# EAGLE design TCRT1010_VIS_onechannel (EAGLE 9.6.2)

## Sheet 1 of 2
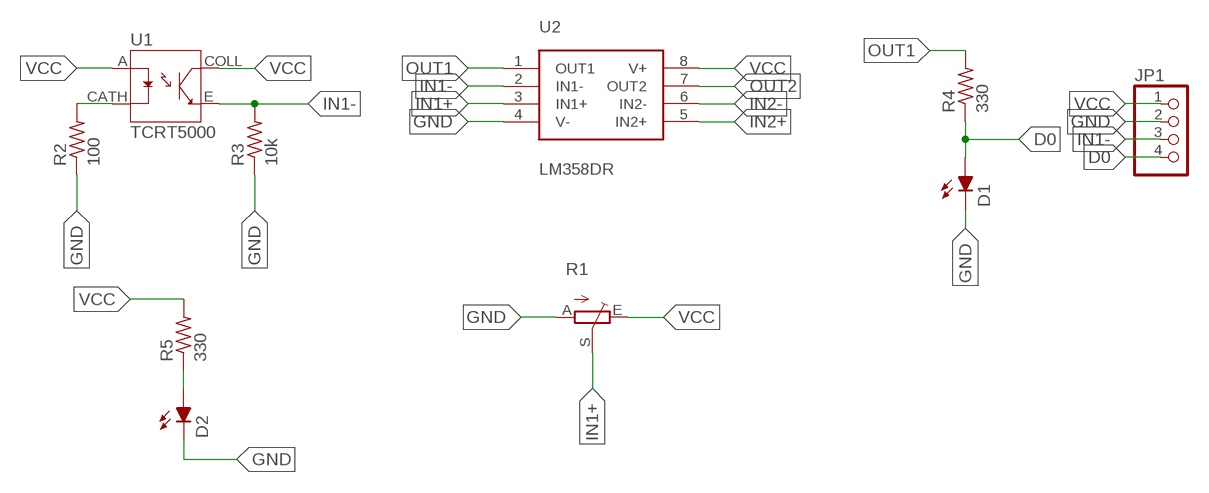
[diagram p0: schematic, sheet 1]

### Parts
D1  LED_LEDCHIP-LED0603MP  [LED_CHIP-LED0603MP]
D2  LED_LEDCHIP-LED0603MP  [LED_CHIP-LED0603MP]
JP1  PINHD-1X4  [1X04]
R1  TRIM_EU-CA6V  [CA6V]
R2  100  R-US_R0805  [R0805]
R3  10k  R-US_R0603  [R0603]
R4  330  R-US_R0603  [R0603]
R5  330  R-US_R0603  [R0603]
U1  TCRT5000  [OPTO_TCRT5000]
U2  LM358DR  [LM358DR]

### Nets
D0: D1.A JP1.4 R4.1
GND: D1.C D2.C JP1.2 R1.A R2.1 R3.1 U2.4(V-)
IN1+: R1.S U2.3(IN1+)
IN1-: JP1.3 R3.2 U1.E U2.2(IN1-)
IN2+: U2.5(IN2+)
IN2-: U2.6(IN2-)
N$1: R2.2 U1.CATH
N$2: D2.A R5.1
OUT1: R4.2 U2.1(OUT1)
OUT2: U2.7(OUT2)
VCC: JP1.1 R1.E R5.2 U1.A U1.COLL U2.8(V+)

## Sheet 2 of 2

## Library data of the parts
D1 D2 = 52101-101-REV-A_v16:LED_LED: LED Various Types
JP1 = MIA_LIBRARY-2-2-2:PINHD-1X4: PIN HEADER
R1 = MIA_LIBRARY-2-2-2:TRIM_EU-: POTENTIOMETER
R2-R5 = rcl:R-US_: RESISTOR, American symbol; SPICEPREFIX: R
U1 = TCRT5000:TCRT5000: 950 nm 60 mA Through Hole Reflective Optical Sensor with Transistor Output Check availability <https://pricing.snapeda.com/parts/TCRT5000/Vishay/view-part?ref=eda>; AVAILABILITY: In Stock; DESCRIPTION: Reflective Optical Sensor 0.591 (15mm) PCB Mount; MF: Vishay; MP: TCRT5000; PACKAGE: TCRT5000 Vishay; PRICE: None; PURCHASE-URL: https://pricing.snapeda.com/search/part/TCRT5000/?ref=eda
U2 = IC:LM358DR: IC OPAMP GP 2 CIRCUIT 8SOIC Manufacturer's datasheet <http://www.ti.com/lit/ds/symlink/lm358.pdf>; CREATED_BY: PCBLayout.com; DIGIKEY_PART_NUMBER: 296-1014-1-ND; MANUFACTURER: Texas Instruments; MPN: LM358DR; PACKAGE: 8-SOIC

## Board
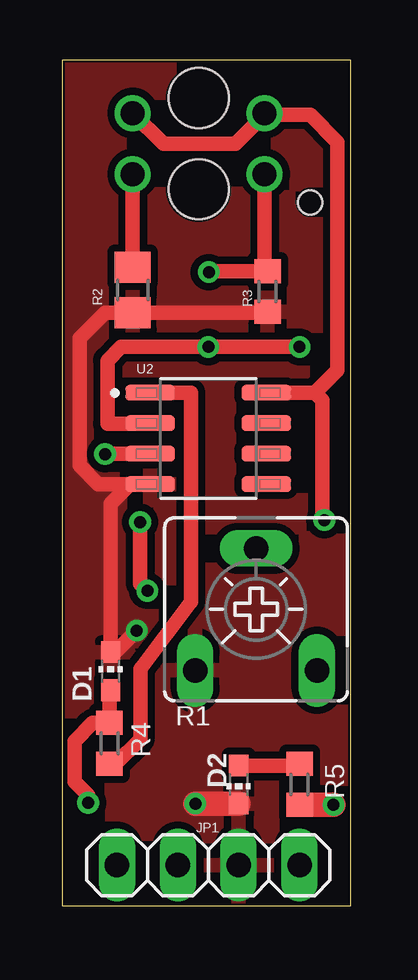
[diagram p1: board, top side]
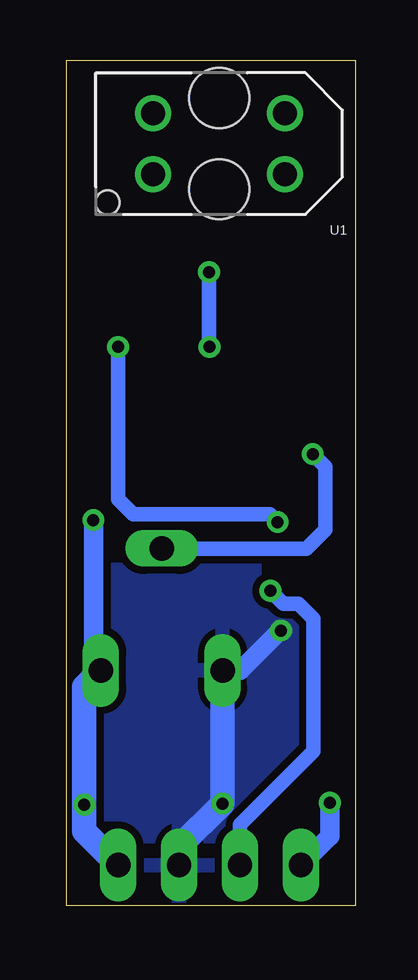
[diagram p2: board, bottom side, seen from below]

Size 12.04 x 35.25 mm. Coordinates in mm from the lower left corner, seen from the top.
Outline: 0,0 12.04,0 12.04,35.24 0,35.25 0,0
Copper layers (1*16): Top 0.035mm / dielectric 1.5mm / Bottom 0.035mm
Design rules "default *": minimum track width 6mil, minimum drill 0.35mm, track to track 0.3mm, track to pad 0.3mm, pad to pad 0.3mm, via to via 0.3mm, smd to smd 0.3mm, copper to edge 4mil, drill to drill 1mil, minimum pad ring 10mil, minimum via ring 8mil, stop-mask expansion 4mil, vias tented up to drill 0mil, thermal gap 10mil

### Footprints (pad centres in the part's own frame; a part is rotated, then mirrored left to right if it is on the bottom)
LED_CHIP-LED0603MP = smd 0.8 x 0.9: A 0,-0.794; C 0,0.794
1X04 = drill 1.016 long: 1 -3.81,0; 2 -1.27,0; 3 1.27,0; 4 3.81,0
CA6V = drill 1.016 long: A -2.54,-2.54; E 2.54,-2.54; S 0,2.54
R0805 = smd 1.3 x 1.5: 1 -0.95,0; 2 0.95,0
R0603 = smd 1 x 1.1: 1 -0.85,0; 2 0.85,0
OPTO_TCRT5000 = drill 1 pad 1.5: A 2.75,1.27; CATH 2.75,-1.27; COLL -2.75,1.27; E -2.75,-1.27 | hole 1: -4.65,-2.45 | hole 2.5: 0,-1.9; 0,1.9
LM358DR = smd 2.07 x 0.66: 1 -2.42,1.905; 2 -2.42,0.635; 3 -2.42,-0.635; 4 -2.42,-1.905; 5 2.42,-1.905; 6 2.42,-0.635; 7 2.42,0.635; 8 2.42,1.905

### Placement (x,y rotation side)
D1  2.01,9.78 0 top
D2  7.36,5.06 180 top
JP1  6.09,1.7 180 top
R1  8.08,12.36 0 top
R2  2.94,25.67 90 top
R3  8.57,25.6 90 top
R4  1.97,6.78 270 top
R5  9.9,5.07 270 top
U1  5.69,31.76 0 bottom
U2  6.09,19.48 0 top

### Tracks (layer width: path | path; a pad name or v marks a point on that pad's centre or on a via)
D0  (via drill 0.5)
  Top 0.61: 2.01,9.06 D1.A 1.97,8.94 R4.1 1.27,7.63 0.51,6.87 0.51,5.17 1.07,4.61 v1.07,4.3
  Bottom 0.813: v1.07,4.3 1.07,2.91 JP1.4
GND  (via drill 0.5)
  Top 0.61: R3.1 8.6,24.72 R2.1 1.79,24.72 0.73,23.66 0.73,18.35 1.5,17.58 2.83,17.58 | 2.83,17.58 U2.4 | v3.11,11.47 2.21,10.58 D1.C 2.01,16.75 2.83,17.58
  Top 1.016: v5.55,4.27 D2.C
  Bottom 0.813: R1.A 4.81,9.82 3.15,11.47 v3.11,11.47
  Bottom 1.016: 5.71,9.65 R1.A 5.55,9.81 v5.55,4.27 7.36,2.46 JP1.2
  pour Bottom: -2.27,-2.07 -2.27,38.53 14.48,38.53 14.48,-2.07
  pour Top: -3.94,-2.11 -3.94,39.8 16.51,39.8 16.51,-2.11
IN1+  (via drill 0.5)
  Top 0.61: v1.79,18.83 1.8,18.85 U2.3
  Bottom 0.61: v1.79,18.83 1.26,18.3 1.26,15.67 2.04,14.89 8.08,14.89 R1.S
IN1-  (via drill 0.5)
  Top 0.61: v6.11,26.41 6.15,26.45 R3.2 8.44,26.58 U1.E | U2.2 3.65,20.1 1.89,20.1 1.89,22.72 2.46,23.29 v6.09,23.29 v9.9,23.29 | v3.25,15.99 3.25,13.43 v3.55,13.13
  Bottom 0.61: v6.11,26.41 6.11,23.31 v6.09,23.29 | v9.9,23.29 9.9,16.94 9.27,16.31 3.57,16.31 v3.25,15.99 | JP1.3 4.82,3.38 1.76,6.44 1.76,11.97 2.38,12.59 3.01,12.59 v3.55,13.13
N$1
  Top 0.61: U1.CATH R2.2
N$2
  Top 0.61: D2.A 9.83,5.85 R5.1
OUT1
  Top 0.61: R4.2 1.98,5.92 2.22,5.92 3.26,6.96 3.26,9.88 5.37,12.68 5.37,21.39 U2.1
VCC  (via drill 0.5)
  Top 0.61: U2.8 10.53,21.39 | 10.53,21.39 11.47,22.32 11.47,31.83 10.34,32.96 8.44,32.96 | 10.53,21.39 10.85,21.07 10.85,16.17 v10.93,16.08 | U1.A 4.22,31.75 7.23,31.75 8.44,32.96 | 8.44,32.96 U1.COLL
  Top 1.016: v11.31,4.21 R5.2
  Bottom 0.813: v10.93,16.08 10.93,10.13 R1.E
  Bottom 1.016: R1.E 11.31,9.13 v11.31,4.21 11.31,3.12 JP1.1